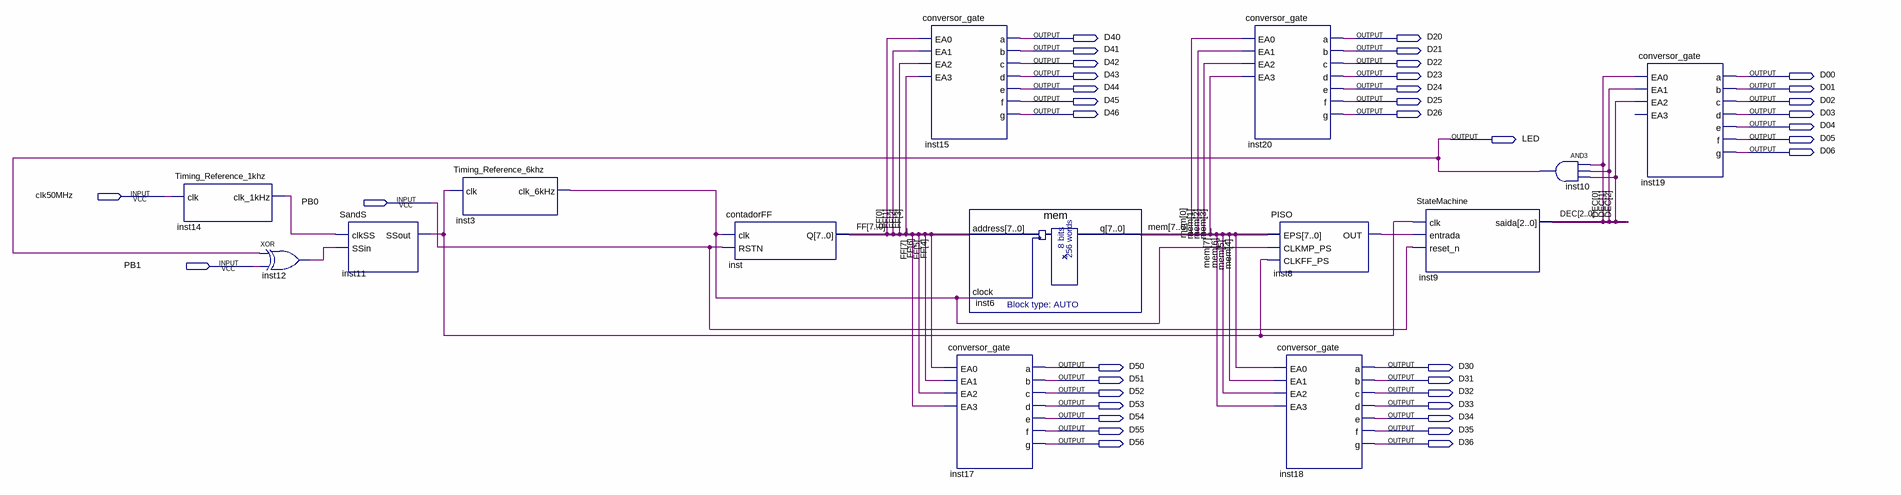
[diagram p0: schematic sheet]
// Quartus schematic build_dec_seq.bdf as structural Verilog: 14 symbols, 39 pins
module build_dec_seq (
  input  clk50MHz,
  input  PB0,
  input  PB1,
  output D40,
  output D20,
  output D41,
  output D21,
  output D42,
  output D22,
  output D43,
  output D23,
  output D00,
  output D44,
  output D24,
  output D01,
  output D45,
  output D25,
  output D02,
  output D46,
  output D26,
  output D03,
  output D04,
  output LED,
  output D05,
  output D06,
  output D50,
  output D30,
  output D51,
  output D31,
  output D52,
  output D32,
  output D53,
  output D33,
  output D54,
  output D34,
  output D55,
  output D35,
  output D56,
  output D36
);

  wire inst3_clk_6khz, inst8_out, inst11_ssout, inst12_out, inst14_clk_1khz;
  wire [2:0] DEC;
  wire [7:0] FF, mem;

  Timing_Reference_1khz inst14 (.clk(clk50MHz), .clk_1kHz(inst14_clk_1khz));
  xor inst12 (inst12_out, LED, PB1);
  SandS inst11 (.clkSS(inst14_clk_1khz), .SSin(inst12_out), .SSout(inst11_ssout));
  Timing_Reference_6khz inst3 (.clk(inst11_ssout), .clk_6kHz(inst3_clk_6khz));
  contadorFF inst (.clk(inst3_clk_6khz), .RSTN(PB0), .Q(FF));
  conversor_gate inst15 (
    .EA0(FF[0]), .EA1(FF[1]), .EA2(FF[2]), .EA3(FF[3]), .a(D40), .b(D41), .c(D42), .d(D43), .e(D44), .f(D45),
    .g(D46));
  conversor_gate inst17 (
    .EA0(FF[4]), .EA1(FF[5]), .EA2(FF[6]), .EA3(FF[7]), .a(D50), .b(D51), .c(D52), .d(D53), .e(D54), .f(D55),
    .g(D56));
  mem inst6 (.address(FF), .clock(inst3_clk_6khz), .q(mem));
  conversor_gate inst20 (
    .EA0(mem[0]), .EA1(mem[1]), .EA2(mem[2]), .EA3(mem[3]), .a(D20), .b(D21), .c(D22), .d(D23), .e(D24),
    .f(D25), .g(D26));
  PISO inst8 (.EPS(mem), .CLKMP_PS(inst3_clk_6khz), .CLKFF_PS(inst11_ssout), .OUT(inst8_out));
  conversor_gate inst18 (
    .EA0(mem[4]), .EA1(mem[5]), .EA2(mem[6]), .EA3(mem[7]), .a(D30), .b(D31), .c(D32), .d(D33), .e(D34),
    .f(D35), .g(D36));
  StateMachine inst9 (.clk(inst11_ssout), .entrada(inst8_out), .reset_n(PB0), .saida(DEC));
  and inst10 (LED, DEC[0], DEC[1], DEC[2]);
  conversor_gate inst19 (
    .EA0(DEC[0]), .EA1(DEC[1]), .EA2(DEC[2]), .a(D00), .b(D01), .c(D02), .d(D03), .e(D04), .f(D05), .g(D06));  // open: EA3
endmodule
